# Altium project 3_band_EQ.PrjPcb
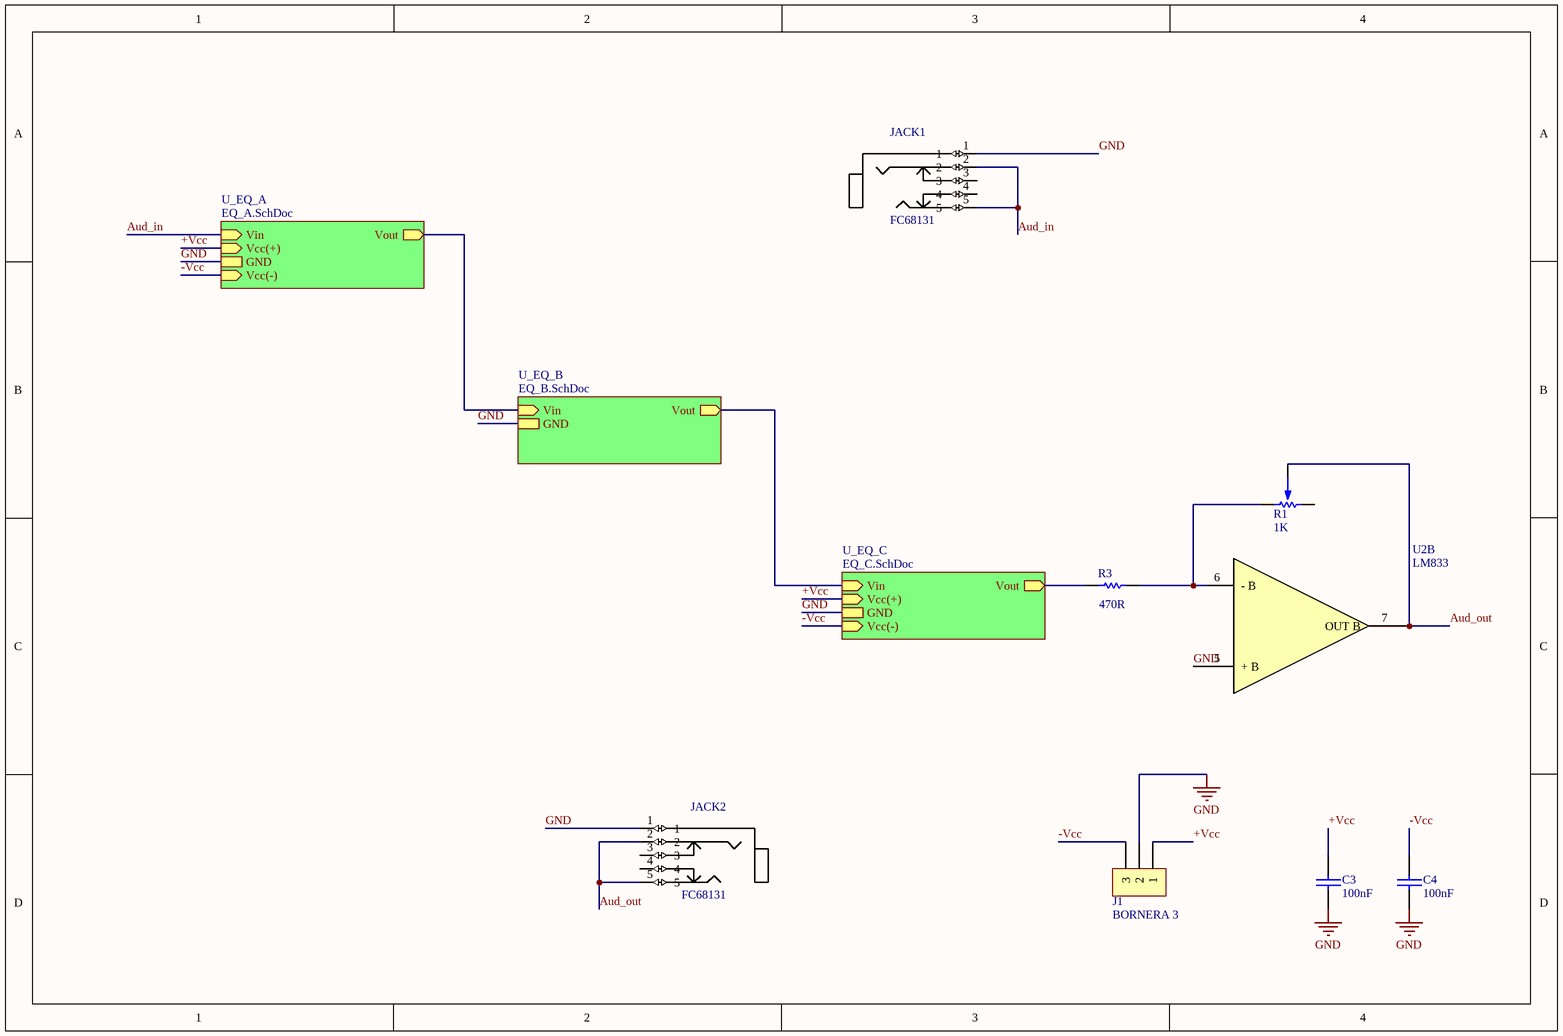
[diagram p0: Top.SchDoc]
4 sheets, 30 parts. Net scope: hierarchical (ports join the sheet entries above them; power ports are global).
Board file: PCB2.PcbDoc
Sheets:
  Top.SchDoc
    U_EQ_A = EQ_A.SchDoc
    U_EQ_B = EQ_B.SchDoc
    U_EQ_C = EQ_C.SchDoc

## Sheet Top.SchDoc
size A4

### Parts
C3  100nF  [CAP200]
C4  100nF  [CAP200]
J1  BORNERA 3  [BORNERA3]
JACK1  FC68131  [*FC68131-5P]
JACK2  FC68131  [*FC68131-5P]
R1  1K  [POTENCIOMETRO]
R3  470R  [0805]
U2  LM833  [DIP8]  (part B of 2)

### Sub-sheets
U_EQ_A = EQ_A.SchDoc: Vin (in), Vout (out), Vcc(+) (in), GND, Vcc(-) (in)  | C1_value: 47nF; R3_value: 1M; POT_value: 100K; R1_value: 120R; C2_value: 470nF
U_EQ_B = EQ_B.SchDoc: Vin (in), Vout (out), GND  | POT_value: 1K; R3_value: 10K; R1_value: 120R; C2_value: 47nF; C1_value: 470nF
U_EQ_C = EQ_C.SchDoc: Vin (in), Vout (out), Vcc(+) (in), GND, Vcc(-) (in)  | POT_value: 1K; R3_value: 10K; R1_value: 150R; C2_value: 5.6nF; C1_value: 56nF

### Nets
GND: C3.2 C4.1 J1.2 JACK1.1 JACK2.1 U2.5(+_B) ; sheet U_EQ_A/GND, sheet U_EQ_B/GND, sheet U_EQ_C/GND
+Vcc: C3.1 J1.1 ; sheet U_EQ_A/Vcc(+), sheet U_EQ_C/Vcc(+)
-Vcc: C4.2 J1.3 ; sheet U_EQ_A/Vcc(-), sheet U_EQ_C/Vcc(-)
Aud_in: JACK1.2 JACK1.5 ; sheet U_EQ_A/Vin
Aud_out: JACK2.2 JACK2.5 R1.2 U2.7(OUT_B)
NetR1_1: R1.1 R3.2 U2.6(-_B)
NetR1a_b_1: sheet U_EQ_A/Vout, sheet U_EQ_B/Vin
NetR1a_c_1: sheet U_EQ_B/Vout, sheet U_EQ_C/Vin
NetR1b_c_2: R3.1 ; sheet U_EQ_C/Vout

Not connected (* = marked no-connect by the designer): JACK1 3 4; JACK2 3 4; R1 3

### Library data of the parts
C3 C4 = CAP
JACK1 JACK2 = FC68131: Stereo Jack, 3.5mm, 3pos, Pcb; MF: Cliff; SnapEDA_Link: https://www.snapeda.com/parts/FC68131/Cliff%20Electronics/view-part/?ref=snap; MP: FC68131; Availability: Unavailable; Package: None; Price: None; Value: *
R1 = POTENCIOMETRO
R3 = RES
U2 = LM833: Dual Audio Operational Amplifier

## Sheet EQ_A.SchDoc
size A4
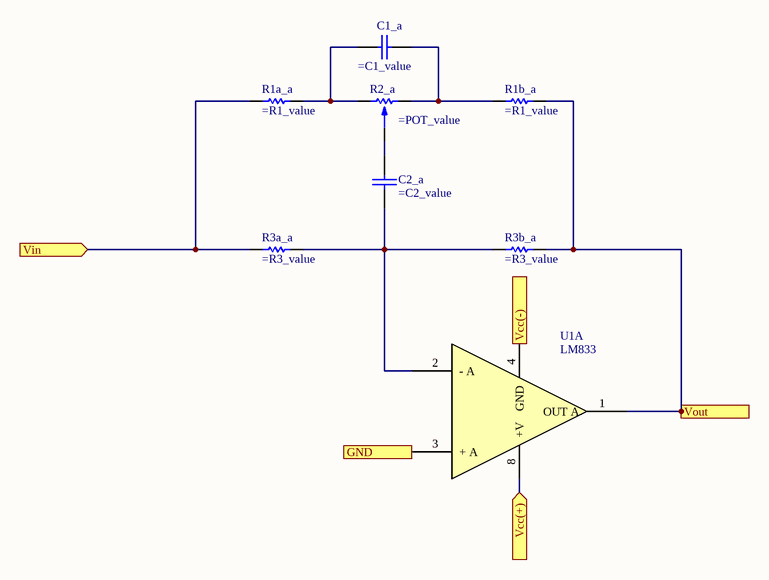
[diagram p1: EQ_A.SchDoc]

### Parts
C1_a  (no value)  [CAP200]
C2_a  (no value)  [CAP200]
R1a_a  (no value)  [0805]
R1b_a  (no value)  [0805]
R2_a  (no value)  [POTENCIOMETRO]
R3a_a  (no value)  [0805]
R3b_a  (no value)  [0805]
U1  LM833  [DIP8]  (part A of 2)

### Ports
GND, Vcc(+) (in), Vcc(-) (in), Vin (in), Vout (out)

### Nets
GND: U1.3(+_A) ; port GND
+Vcc: U1.8(+V) ; port Vcc(+)
-Vcc: U1.4(GND) ; port Vcc(-)
Aud_in: R1a_a.1 R3a_a.1 ; port Vin
NetC1_a_1: C1_a.1 R1a_a.2 R2_a.3
NetC1_a_2: C1_a.2 R1b_a.1 R2_a.1
NetC2_a_1: C2_a.1 R2_a.2
NetC2_a_2: C2_a.2 R3a_a.2 R3b_a.1 U1.2(-_A)
NetR1a_b_1: R1b_a.2 R3b_a.2 U1.1(OUT_A) ; port Vout

### Library data of the parts
C1_a C2_a = CAP
R1a_a R1b_a R3a_a R3b_a = RES
R2_a = POTENCIOMETRO
U1 = LM833: Dual Audio Operational Amplifier

## Sheet EQ_B.SchDoc
size A4
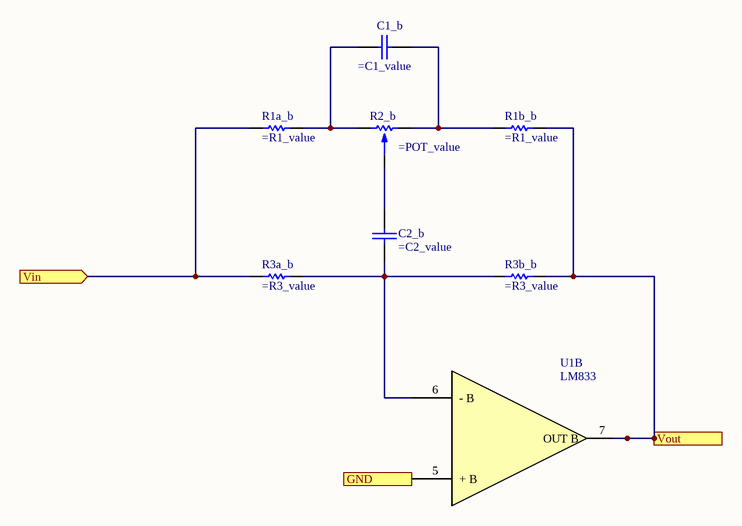
[diagram p2: EQ_B.SchDoc]

### Parts
C1_b  (no value)  [CAP200]
C2_b  (no value)  [CAP200]
R1a_b  (no value)  [0805]
R1b_b  (no value)  [0805]
R2_b  (no value)  [POTENCIOMETRO]
R3a_b  (no value)  [0805]
R3b_b  (no value)  [0805]
U1  LM833  [DIP8]  (part B of 2)

### Ports
GND, Vin (in), Vout (out)

### Nets
GND: U1.5(+_B) ; port GND
NetC1_b_1: C1_b.1 R1a_b.2 R2_b.3
NetC1_b_2: C1_b.2 R1b_b.1 R2_b.1
NetC2_b_1: C2_b.1 R2_b.2
NetC2_b_2: C2_b.2 R3a_b.2 R3b_b.1 U1.6(-_B)
NetR1a_b_1: R1a_b.1 R3a_b.1 ; port Vin
NetR1a_c_1: R1b_b.2 R3b_b.2 U1.7(OUT_B) ; port Vout

### Library data of the parts
C1_b C2_b = CAP
R1a_b R1b_b R3a_b R3b_b = RES
R2_b = POTENCIOMETRO
U1 = LM833: Dual Audio Operational Amplifier

## Sheet EQ_C.SchDoc
size A4
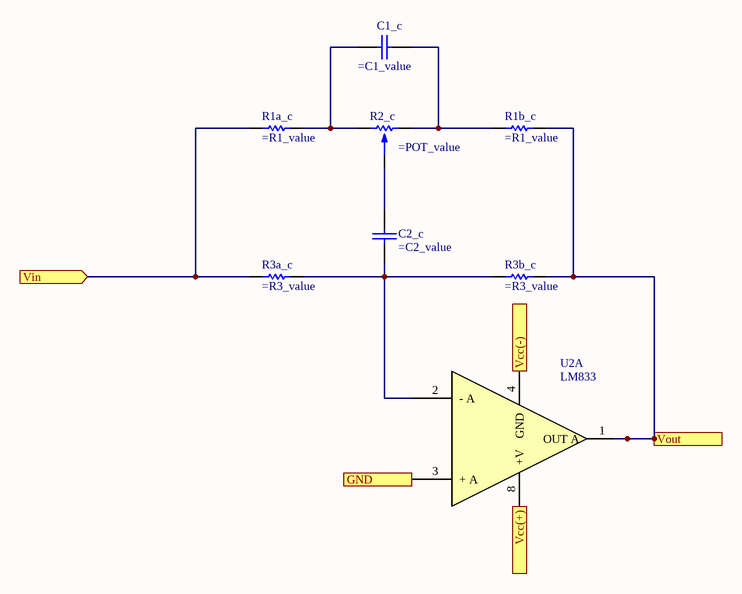
[diagram p3: EQ_C.SchDoc]

### Parts
C1_c  (no value)  [CAP200]
C2_c  (no value)  [CAP200]
R1a_c  (no value)  [0805]
R1b_c  (no value)  [0805]
R2_c  (no value)  [POTENCIOMETRO]
R3a_c  (no value)  [0805]
R3b_c  (no value)  [0805]
U2  LM833  [DIP8]  (part A of 2)

### Ports
GND, Vcc(+) (in), Vcc(-) (in), Vin (in), Vout (out)

### Nets
GND: U2.3(+_A) ; port GND
+Vcc: U2.8(+V) ; port Vcc(+)
-Vcc: U2.4(GND) ; port Vcc(-)
NetC1_c_1: C1_c.1 R1a_c.2 R2_c.3
NetC1_c_2: C1_c.2 R1b_c.1 R2_c.1
NetC2_c_1: C2_c.1 R2_c.2
NetC2_c_2: C2_c.2 R3a_c.2 R3b_c.1 U2.2(-_A)
NetR1a_c_1: R1a_c.1 R3a_c.1 ; port Vin
NetR1b_c_2: R1b_c.2 R3b_c.2 U2.1(OUT_A) ; port Vout

### Library data of the parts
C1_c C2_c = CAP
R1a_c R1b_c R3a_c R3b_c = RES
R2_c = POTENCIOMETRO
U2 = LM833: Dual Audio Operational Amplifier

## Nets that join several sheets
GND: Top (6 pins), EQ_A (U1.3), EQ_B (U1.5), EQ_C (U2.3)
+Vcc: Top (C3.1 J1.1), EQ_A (U1.8), EQ_C (U2.8)
-Vcc: Top (C4.2 J1.3), EQ_A (U1.4), EQ_C (U2.4)
Aud_in: Top (JACK1.2 JACK1.5), EQ_A (R1a_a.1 R3a_a.1)
NetR1a_b_1: EQ_A (R1b_a.2 R3b_a.2 U1.1), EQ_B (R1a_b.1 R3a_b.1)
NetR1a_c_1: EQ_B (R1b_b.2 R3b_b.2 U1.7), EQ_C (R1a_c.1 R3a_c.1)
NetR1b_c_2: Top (R3.1), EQ_C (R1b_c.2 R3b_c.2 U2.1)